# Altium project SIPROKAR_Output.PrjPcb
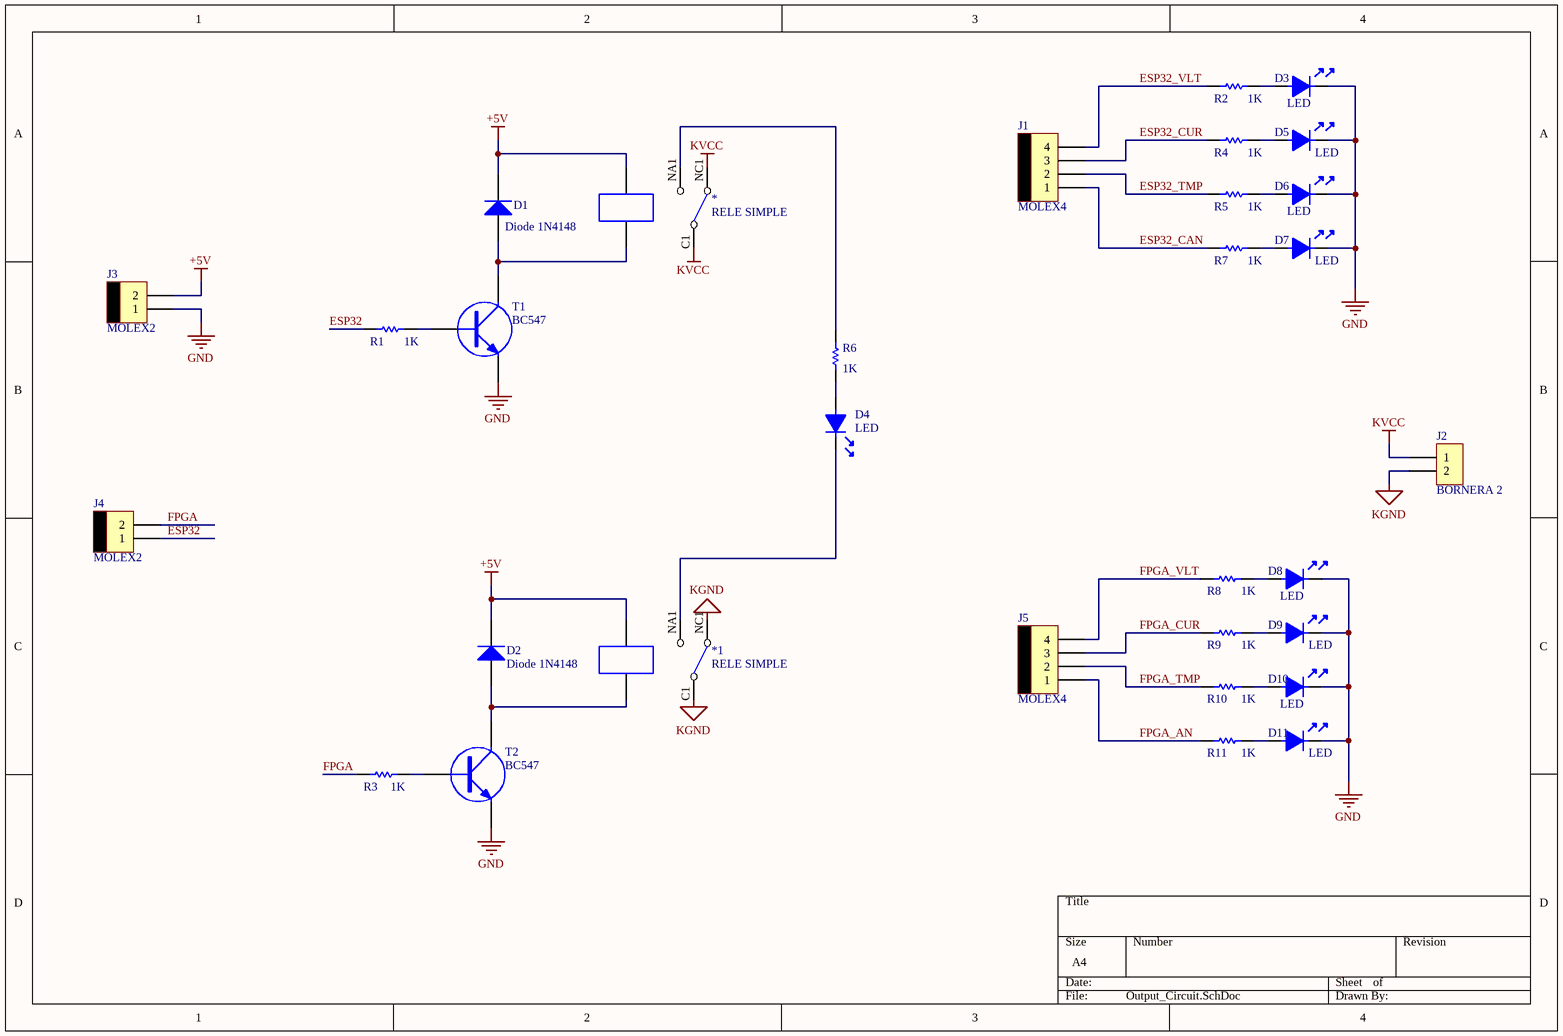
[diagram p0: Output_Circuit.SchDoc]
CAGE_CODE: ?????; CONTRACT_NUMBER: <CONTRACT NO>; DOC_NO_ASSY_DWG: <ASSY DWG NO>; DOC_NO_BOM: <BOM DOC NO>; DOC_NO_FAB_DWG: <FAB DWG NO>; DOC_NO_SCH_DWG: <SCH DWG NO>; PCB_2_DEC_TOL: +/-.01; PCB_3_DEC_TOL: +/-.010; PCB_ANG_TOL: +/-1/2; PCB_ASSEMBLY_NO: <PCB ASSY NO>; PCB_CHECKER: - -----; PCB_CHECKER_APP_DATE: --/--/----; PCB_DESIGNER: - -----; PCB_DESIGNER_APP_DATE: --/--/----; PCB_DWG_NO: <PCB DWG NO>; PCB_ENGINEER: - -----; PCB_ENGINEER_APP_DATE: --/--/----; PCB_PART_NUMBER: <PCB PN>; PCB_REV: A; SCH_REV: A
1 sheet, 31 parts. Net scope: global (net labels, ports and power ports of the same name join across sheets).
Board file: Output_Circuit.PcbDoc

## Sheet Output_Circuit.SchDoc
size A4; SheetNumber: 1; SheetTotal: 1; SPICEModelCacheYGETVCTW: <root> / <DocumentId>YGETVCTW</DocumentId> / <CacheFrame Number="0"> / <Model Name="1n4148" Kind="MDL"> / <Text>.model 1N4148  D(Is=0.1p Rs=16 CJO=2p Tt=12n Bv=100 Ibv=0.1p)</Text> / </Model> / </CacheFrame> / </root>

### Parts
*  RELE SIMPLE  [RELE SERIE 964]
*1  RELE SIMPLE  [RELE SERIE 964]
D1  Diode 1N4148  [DO-35]
D2  Diode 1N4148  [DO-35]
D3  LED  [LED5]
D4  LED  [LED5]
D5  LED  [LED5]
D6  LED  [LED5]
D7  LED  [LED5]
D8  LED  [LED5]
D9  LED  [LED5]
D10  LED  [LED5]
D11  LED  [LED5]
J1  MOLEX4  [MOLEX4]
J2  BORNERA 2  [BORNERA2]
J3  MOLEX2  [MOLEX2]
J4  MOLEX2  [MOLEX2]
J5  MOLEX4  [MOLEX4]
R1  1K  [RES400]
R2  1K  [RES400]
R3  1K  [RES400]
R4  1K  [RES400]
R5  1K  [RES400]
R6  1K  [RES400]
R7  1K  [RES400]
R8  1K  [RES400]
R9  1K  [RES400]
R10  1K  [RES400]
R11  1K  [RES400]
T1  BC547  [TO92]
T2  BC547  [TO92]

### Nets
+5V: *.B1 *1.B1 D1.2(K) D2.2(K) J3.2
GND: D3.2 D5.2 D6.2 D7.2 D8.2 D9.2 D10.2 D11.2 J3.1 T1.3(E) T2.3(E)
KGND: *1.C1 *1.NC1 J2.2
KVCC: *.C1 *.NC1 J2.1
ESP32: J4.1 R1.1
ESP32_CAN: J1.1 R7.1
ESP32_CUR: J1.3 R4.1
ESP32_TMP: J1.2 R5.1
ESP32_VLT: J1.4 R2.1
FPGA: J4.2 R3.1
FPGA_AN: J5.1 R11.1
FPGA_CUR: J5.3 R9.1
FPGA_TMP: J5.2 R10.1
FPGA_VLT: J5.4 R8.1
Net*1_B2: *1.B2 D2.1(A) T2.2(C)
Net*1_NA1: *1.NA1 D4.2
Net*_B2: *.B2 D1.1(A) T1.2(C)
Net*_NA1: *.NA1 R6.2
NetD3_1: D3.1 R2.2
NetD4_1: D4.1 R6.1
NetD5_1: D5.1 R4.2
NetD6_1: D6.1 R5.2
NetD7_1: D7.1 R7.2
NetD8_1: D8.1 R8.2
NetD9_1: D9.1 R9.2
NetD10_1: D10.1 R10.2
NetD11_1: D11.1 R11.2
NetR1_2: R1.2 T1.1(B)
NetR3_2: R3.2 T2.1(B)

### Library data of the parts
D1 D2 = CMP-004-00051-1: High Conductance Fast Diode; PackageReference: DO-35; ComponentLink1URL: http://www.fairchildsemi.com/; Published: 8-Jun-2000; LatestRevisionNote: Re-released for DXP Platform.; LatestRevisionDate: 17-Jul-2002; Case/Package: Diode, Axial; Body 3.8 x 1.9 mm (LxDia. max), Lead Dia. 0.53 mm (max); Signal Integrity: 1N4148; ComponentLink2URL: http://www.fairchildsemi.com/ds/1N%2F1N4148.pdf; Pins: 2; ComponentLink2Description: Datasheet; ComponentLink1Description: Manufacturer Link; Publisher: Altium Limited; Component Type: Standard; DatasheetVersion: 1997; Design Item ID: Diode 1N4148; Code_JEDEC: DO-204-AH; Source: Miscellaneous Devices.SchLib
D3-D11 = CMP-004-00081-1: Source: Schematics.SchLib; Component Type: Standard; Pins: 2; Design Item ID: LED
J2 = CMP-043-000008-1: Pin Count: 2; Component Type: Standard; Source: Schematics.SchLib; Design Item ID: BORNERA 2
R1-R11 = CMP-009-00195-1: Component Type: Standard; Source: Schematics.SchLib; Pins: 2; Design Item ID: RES
T1 T2 = CMP-012-00019-1: Component Type: Standard; Source: Schematics.SchLib; Design Item ID: TRANSISTOR NPN; Pins: 3